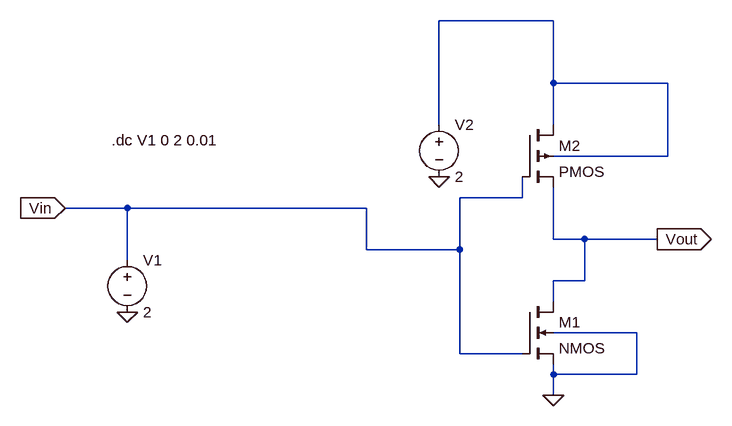
[diagram p0: schematic CMOS inverter using DC sweep.asc]
CMOS inverter using DC sweep.asc, the LTspice schematic file:
Version 4.1
SHEET 1 944 680
WIRE 672 -192 496 -192
WIRE 672 -96 672 -192
WIRE 848 -96 672 -96
WIRE 496 -32 496 -192
WIRE 672 -32 672 -96
WIRE 848 16 848 -96
WIRE 848 16 672 16
WIRE 624 80 624 48
WIRE 624 80 528 80
WIRE 16 96 -80 96
WIRE 384 96 16 96
WIRE 672 144 672 64
WIRE 720 144 672 144
WIRE 832 144 720 144
WIRE 384 160 384 96
WIRE 528 160 528 80
WIRE 528 160 384 160
WIRE 16 176 16 96
WIRE 720 208 720 144
WIRE 720 208 672 208
WIRE 672 240 672 208
WIRE 800 288 672 288
WIRE 528 320 528 160
WIRE 624 320 528 320
WIRE 672 352 672 336
WIRE 800 352 800 288
WIRE 800 352 672 352
WIRE 672 384 672 352
FLAG -80 96 Vin
IOPIN -80 96 In
FLAG 832 144 Vout
IOPIN 832 144 Out
FLAG 16 256 0
FLAG 496 48 0
FLAG 672 384 0
SYMBOL voltage 16 160 R0
WINDOW 123 0 0 Left 0
WINDOW 39 0 0 Left 0
SYMATTR InstName V1
SYMATTR Value 2
SYMBOL pmos4 624 -32 R0
SYMATTR InstName M2
SYMBOL nmos4 624 240 R0
SYMATTR InstName M1
SYMBOL voltage 496 -48 R0
WINDOW 123 0 0 Left 0
WINDOW 39 0 0 Left 0
SYMATTR InstName V2
SYMATTR Value 2
TEXT -8 -8 Left 2 !.dc V1 0 2 0.01

The netlist it stands for:
* CMOS inverter using DC sweep.asc
V1 Vin 0 2
M2 N001 Vin Vout N001 PMOS
M1 Vout Vin 0 0 NMOS
V2 N001 0 2
.model NMOS NMOS
.model PMOS PMOS
.lib standard.mos
.dc V1 0 2 0.01
.backanno
.end